# Altium schematic sheet Input_amplifiers.SchDoc: Input signal amplifiers
size A4; Date: 6.4.2015; Engineer: Matjaž Tome; Revision: B; SheetNumber: 7; SheetTotal: 10; Project: USB DAQ
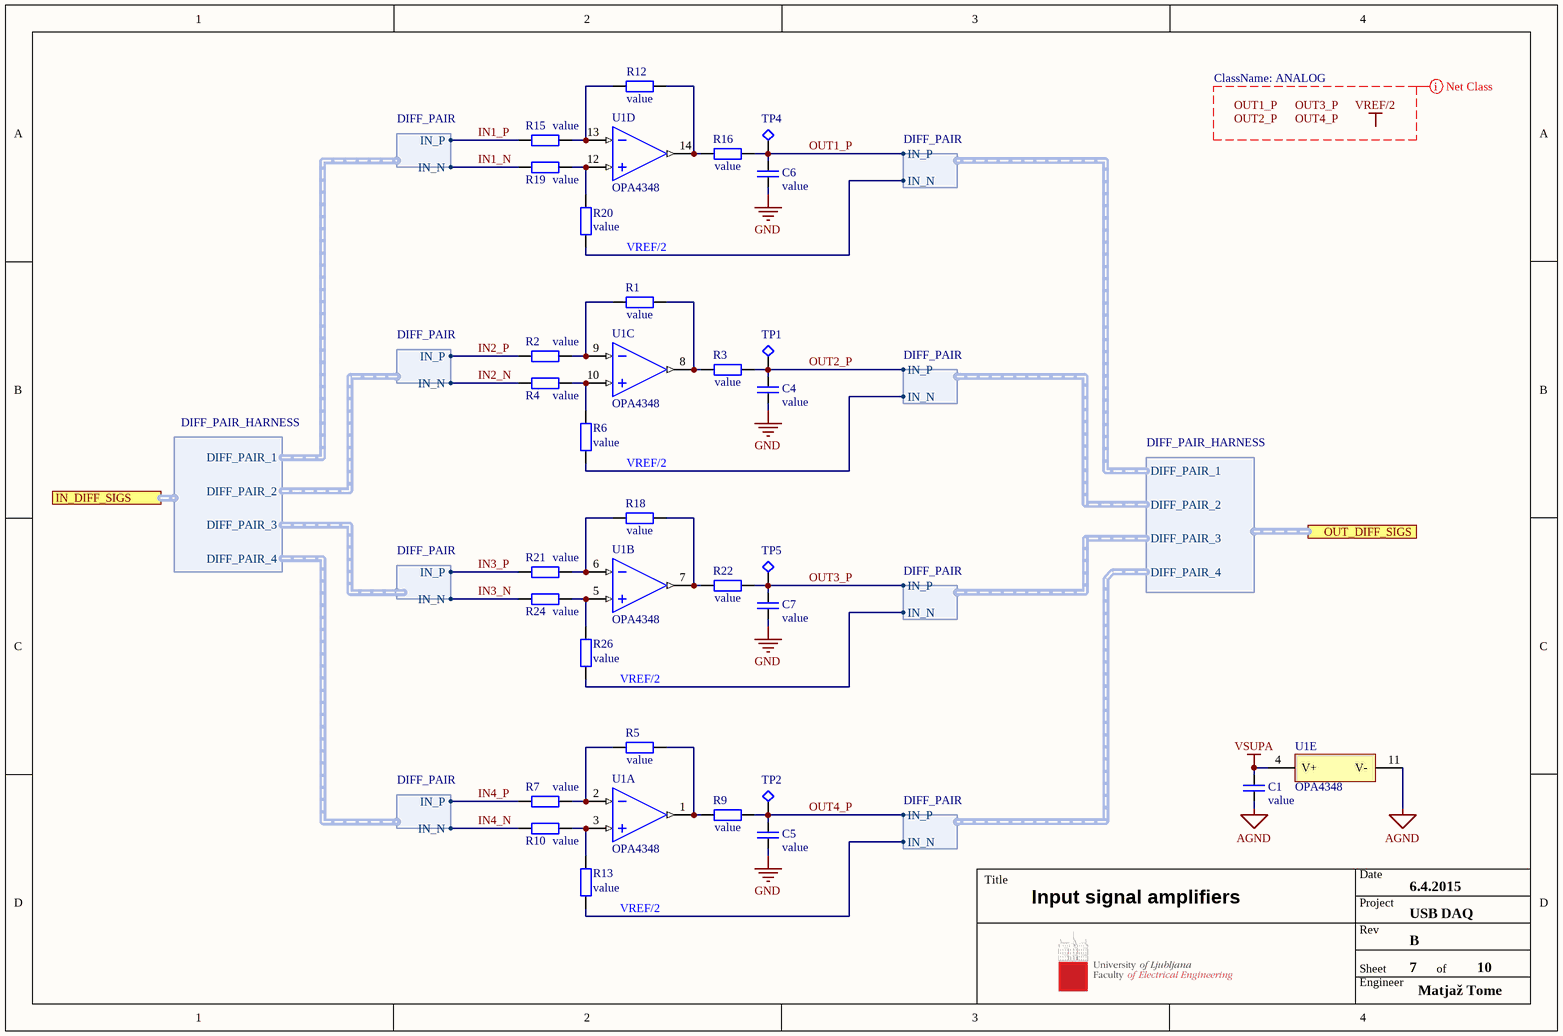
[diagram p0: Input_amplifiers.SchDoc]

## Parts
C1  comment  [C_0603]  (value not drawn)
C4  comment  [C_0603]  (value not drawn)
C5  comment  [C_0603]  (value not drawn)
C6  comment  [C_0603]  (value not drawn)
C7  comment  [C_0603]  (value not drawn)
R1  comment  [R_0603]  (value not drawn)
R2  comment  [R_0603]  (value not drawn)
R3  comment  [R_0603]  (value not drawn)
R4  comment  [R_0603]  (value not drawn)
R5  comment  [R_0603]  (value not drawn)
R6  comment  [R_0603]  (value not drawn)
R7  comment  [R_0603]  (value not drawn)
R9  comment  [R_0603]  (value not drawn)
R10  comment  [R_0603]  (value not drawn)
R12  comment  [R_0603]  (value not drawn)
R13  comment  [R_0603]  (value not drawn)
R15  comment  [R_0603]  (value not drawn)
R16  comment  [R_0603]  (value not drawn)
R18  comment  [R_0603]  (value not drawn)
R19  comment  [R_0603]  (value not drawn)
R20  comment  [R_0603]  (value not drawn)
R21  comment  [R_0603]  (value not drawn)
R22  comment  [R_0603]  (value not drawn)
R24  comment  [R_0603]  (value not drawn)
R26  comment  [R_0603]  (value not drawn)
TP1  test point 1.5mm  [TP1_FULL]  (value not drawn)
TP2  test point 1.5mm  [TP1_FULL]  (value not drawn)
TP4  test point 1.5mm  [TP1_FULL]  (value not drawn)
TP5  test point 1.5mm  [TP1_FULL]  (value not drawn)
U1  OPA4348  [SOIC14]  (parts A,B,C,D,E of 5)

## Ports
IN_DIFF_SIGS (harness DIFF_PAIR_HARNESS), OUT_DIFF_SIGS (harness DIFF_PAIR_HARNESS)

## Harnesses
DIFF_PAIR: IN_P, IN_N
DIFF_PAIR_HARNESS: DIFF_PAIR_1, DIFF_PAIR_2, DIFF_PAIR_3, DIFF_PAIR_4
DIFF_PAIR: IN_N, IN_P
DIFF_PAIR_HARNESS: DIFF_PAIR_4, DIFF_PAIR_3, DIFF_PAIR_2, DIFF_PAIR_1

## Nets
AGND: C1.1 U1.11(V-)
GND: C4.2 C5.2 C6.2 C7.2
VSUPA: C1.2 U1.4(V+)
IN1_N: R19.1 ; harness DIFF_PAIR.IN_N
IN1_P: R15.1 ; harness DIFF_PAIR.IN_P
IN2_N: R4.1 ; harness DIFF_PAIR.IN_N
IN2_P: R2.1 ; harness DIFF_PAIR.IN_P
IN3_N: R24.1 ; harness DIFF_PAIR.IN_N
IN3_P: R21.1 ; harness DIFF_PAIR.IN_P
IN4_N: R10.1 ; harness DIFF_PAIR.IN_N
IN4_P: R7.1 ; harness DIFF_PAIR.IN_P
OUT1_P: C6.1 R16.2 TP4.1 ; harness DIFF_PAIR.IN_P
OUT2_P: C4.1 R3.2 TP1.1 ; harness DIFF_PAIR.IN_P
OUT3_P: C7.1 R22.2 TP5.1 ; harness DIFF_PAIR.IN_P
OUT4_P: C5.1 R9.2 TP2.1 ; harness DIFF_PAIR.IN_P
NetR1_1: R1.1 R2.2 U1.9(-IN_C)
NetR1_2: R1.2 R3.1 U1.8(OUT_C)
NetR4_2: R4.2 R6.2 U1.10(+IN_C)
NetR5_1: R5.1 R7.2 U1.2(-IN_A)
NetR5_2: R5.2 R9.1 U1.1(OUT_A)
NetR6_1: R6.1 ; harness DIFF_PAIR.IN_N
NetR10_2: R10.2 R13.2 U1.3(+IN_A)
NetR12_1: R12.1 R15.2 U1.13(-IN_D)
NetR12_2: R12.2 R16.1 U1.14(OUT_D)
NetR13_1: R13.1 ; harness DIFF_PAIR.IN_N
NetR18_1: R18.1 R21.2 U1.6(-IN_B)
NetR18_2: R18.2 R22.1 U1.7(OUT_B)
NetR19_2: R19.2 R20.2 U1.12(+IN_D)
NetR20_1: R20.1 ; harness DIFF_PAIR.IN_N
NetR24_2: R24.2 R26.2 U1.5(+IN_B)
NetR26_1: R26.1 ; harness DIFF_PAIR.IN_N

## Layout directives
net class ANALOG: OUT1_P, OUT2_P, OUT3_P, OUT4_P, VREF/2

## Notes on the sheet
- VREF/2
- (near R26) VREF/2
- (near R13) VREF/2
- Labels drawn without touching a wire or pin: OUT1_P, OUT2_P, OUT3_P, OUT4_P, VREF/2
- Title
- Date
- Project
- Rev
- Engineer
- Sheet
- of

## Library data of the parts
C1 C4-C7 = Capacitor: Generic capacitor; Value: value
R1-R7 R9 R10 R12 R13 R15 R16 R18-R22 R24 R26 = Resistor: Generic resistor; Value: value
TP1 TP2 TP4 TP5 = Test Point: Test point ,1.5mm diameter, no hole; Category: testpoints
U1 = OPA4348: Operational Amplifiers - Op Amps 1MHz 45uA RRIO Quad Op Amp; Manufacturer: Texas Instruments; Manufacturer Number: OPA4348AID; Dealer number: 595-OPA4348AID; Dealer: Mouser; Supply voltage max: 5.5V; Supply voltage min: 2.1V; Devices: 4; Rail to Rail: IN/OUT; Category: Integrated circuits; Price: 1.64; GBP: 1MHz; Case: SOIC14; Technology: SMT; HelpURL: http://www.ti.com/general/docs/suppproductinfo.tsp?distId=26&gotoUrl=http%3A%2F%2Fwww.ti.com%2Flit%2Fgpn%2Fopa4348